# EAGLE board Replicape (EAGLE 5.12), part 1 of 2
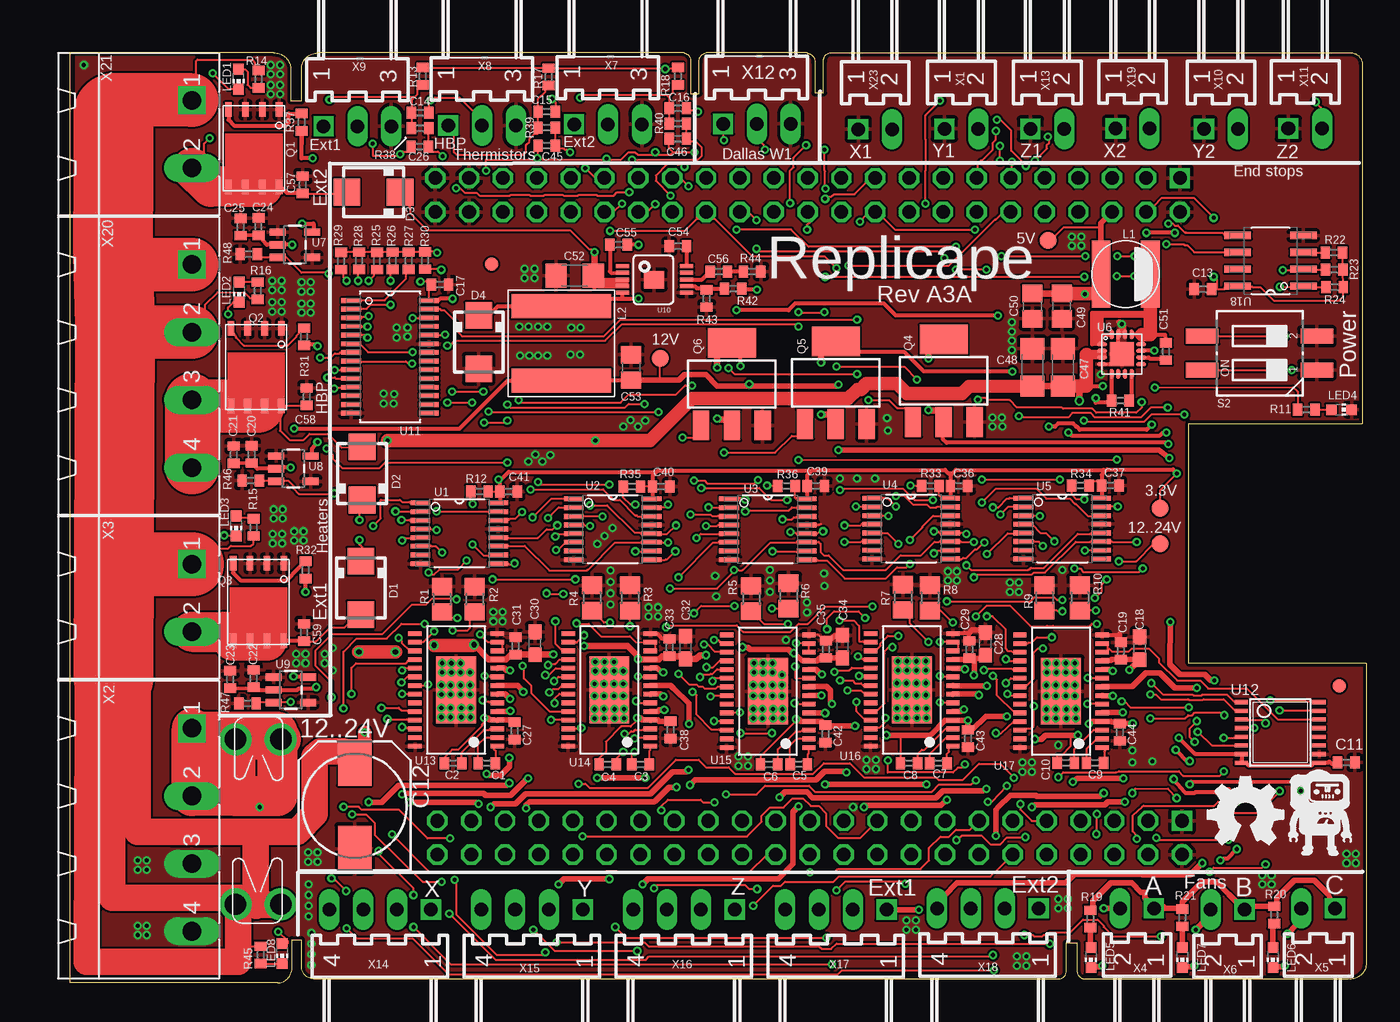
[diagram p3: board, top side]
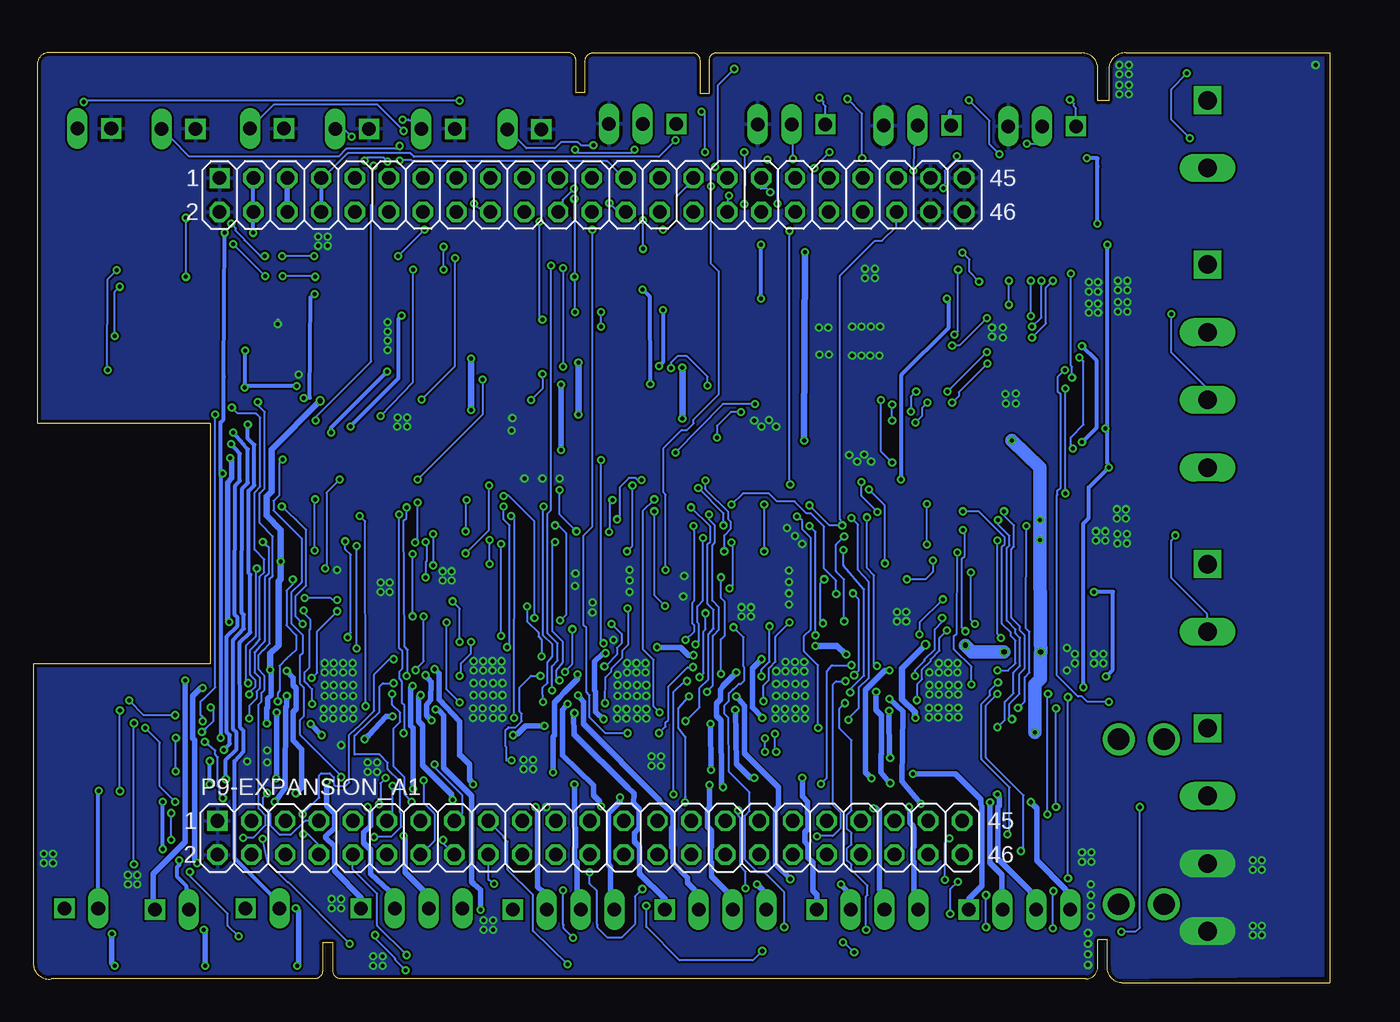
[diagram p4: board, bottom side, seen from below]

Size 97.3 x 69.83 mm. Coordinates in mm from the lower left corner, seen from the top.
Outline: 16.7,3.25 17.4,3.25 17.4,1.3 arc90 18.3,0.3 74.2,0.3 arc90 74.8,0.9 74.8,3 75.6,3 75.6,0.9 arc90 76.2,0.3 95.95,0.3 arc90 97.3,1.35 97.3,24 84,24 84,42 97,42 97,69 arc90 96.05,69.83 57.12,69.83 arc90 56.58,69.15 56.58,66.8 55.92,66.8 55.92,69.1 arc90 55.33,69.8 47.75,69.8 arc90 47.25,69.1 47.25,66.75 46.6,66.75 46.6,69.1 arc90 46.1,69.8 18.6,69.8 arc90 17.4,68.6 17.4,66.2 16.6,66.2 16.6,68.6 arc90 15.3,69.8 0,69.8 0,0 15.6,0 arc90 16.7,1.2 16.7,3.25
Copper layers (1*16): Top 0.035mm / dielectric 1.5mm / Bottom 0.035mm
Design rules "Fusion_eagle_rule_v1.1": minimum track width 6mil, minimum drill 12mil, track to track 6mil, track to pad 6mil, pad to pad 6mil, via to via 6mil, smd to smd 0mil, copper to edge 10mil, drill to drill 10mil, minimum pad ring 10mil, minimum via ring 6mil, stop-mask expansion 2mil, vias tented up to drill 100mil, thermal gap 10mil
Net classes: 1 power: width 1.27 mm

## Footprints (pad centres in the part's own frame; a part is rotated, then mirrored left to right if it is on the bottom)
B1,27 = smd 1.27 x 1.27: TP 0,0
C0402 = smd 0.7 x 0.9: 1 -0.65,0; 2 0.65,0
140CLH-0810 = smd 3.5 x 2.5: + 3.25,0; - -3.25,0
C0603 = smd 1.1 x 1: 1 -0.85,0; 2 0.85,0
C1206 = smd 1.6 x 1.8: 1 -1.4,0; 2 1.4,0
C0805 = smd 1.3 x 1.5: 1 -0.95,0; 2 0.95,0
SMA = smd 2 x 2: A 2,0; C -2,0
3557 = drill 1.6 round: 1 -6.2,1.7; 2 -6.2,-1.7; 3 6.2,-1.7; 4 6.2,1.7
FIDUCIAL-1X2.5 = smd 1 x 1: 1 0,0
VLC5020 = smd 5 x 1.4: 1 0,1.85; 2 0,-1.85
NR8040T330 = smd 1.8 x 7.5: P$1 2.8,0; P$2 -2.8,0
CHIP-LED0603 = smd 0.8 x 0.8: A 0,-0.75; C 0,0.75
2X23 = drill 1.016 square: 1 -30.48,1.27 | drill 1.016 octagon: 2 -30.48,-1.27; 3 -27.94,1.27; 4 -27.94,-1.27; 5 -25.4,1.27; 6 -25.4,-1.27; 7 -22.86,1.27; 8 -22.86,-1.27; 9 -20.32,1.27; 10 -20.32,-1.27; 11 -17.78,1.27; 12 -17.78,-1.27; 13 -15.24,1.27; 14 -15.24,-1.27; 15 -12.7,1.27; 16 -12.7,-1.27; 17 -10.16,1.27; 18 -10.16,-1.27; 19 -7.62,1.27; 20 -7.62,-1.27; 21 -5.08,1.27; 22 -5.08,-1.27; 23 -2.54,1.27; 24 -2.54,-1.27; 25 0,1.27; 26 0,-1.27; 27 2.54,1.27; 28 2.54,-1.27; 29 5.08,1.27; 30 5.08,-1.27; 31 7.62,1.27; 32 7.62,-1.27; 33 10.16,1.27; 34 10.16,-1.27; 35 12.7,1.27; 36 12.7,-1.27; 37 15.24,1.27; 38 15.24,-1.27; 39 17.78,1.27; 40 17.78,-1.27; 41 20.32,1.27; 42 20.32,-1.27; 43 22.86,1.27; 44 22.86,-1.27; 45 25.4,1.27; 46 25.4,-1.27
8-DFN-EP-(5X6) = smd 1.1 x 0.5: 1 -2.9,2.005; 2 -2.9,0.735; 3 -2.9,-0.535; 4 -2.9,-1.805; 5 2.9,-1.805; 6 2.9,-0.535; 7 2.9,0.735; 8 2.9,2.005
SOT223 = smd 1.219 x 2.235: 1 -2.311,-3.099; 2 0,-3.099; 3 2.311,-3.099 | smd 3.6 x 2.2: 4 0,3.099
R0805 = smd 1.3 x 1.5: 1 -0.95,0; 2 0.95,0
R0402 = smd 0.7 x 0.9: 1 -0.65,0; 2 0.65,0
CTS-219-02 = smd 1.13 x 2.44: 1 -1.27,-4.3; 2 1.27,-4.3; 3 1.27,4.3; 4 -1.27,4.3
SOP65P640X120-16N = smd 1.473 x 0.356: 1 -2.921,2.286; 2 -2.921,1.626; 3 -2.921,0.965; 4 -2.921,0.33; 5 -2.921,-0.33; 6 -2.921,-0.965; 7 -2.921,-1.626; 8 -2.921,-2.286; 9 2.921,-2.286; 10 2.921,-1.626; 11 2.921,-0.965; 12 2.921,-0.33; 13 2.921,0.33; 14 2.921,0.965; 15 2.921,1.626; 16 2.921,2.286
QFN-16 = smd 0.75 x 0.3: 1 -1.475,0.75; 2 -1.475,0.25; 3 -1.475,-0.25; 4 -1.475,-0.75; 9 1.475,-0.75; 10 1.475,-0.25; 11 1.475,0.25; 12 1.475,0.75 | smd 0.3 x 0.75: 5 -0.75,-1.475; 6 -0.25,-1.475; 7 0.25,-1.475; 8 0.75,-1.475; 13 0.75,1.475; 14 0.25,1.475; 15 -0.25,1.475; 16 -0.75,1.475 | smd 1.8 x 1.8: P$17 0,0
SOT23-5 = smd 0.55 x 1.2: 1 -0.95,-1.3; 2 0,-1.3; 3 0.95,-1.3; 4 0.95,1.3; 5 -0.95,1.3
MSOP10 = smd 0.3 x 1: 1 -1,-2.4; 2 -0.5,-2.4; 3 0.005,-2.4; 4 0.5,-2.4; 5 1,-2.4; 6 1,2.4; 7 0.5,2.4; 8 0.005,2.4; 9 -0.5,2.4; 10 -1,2.4 | smd 1.3 x 1.5: EP 0.02,-0.04
SOP65P640X110-28N = smd 1.473 x 0.356: 1 -2.921,4.216; 2 -2.921,3.581; 3 -2.921,2.921; 4 -2.921,2.286; 5 -2.921,1.626; 6 -2.921,0.965; 7 -2.921,0.33; 8 -2.921,-0.33; 9 -2.921,-0.965; 10 -2.921,-1.626; 11 -2.921,-2.286; 12 -2.921,-2.921; 13 -2.921,-3.581; 14 -2.921,-4.216; 15 2.921,-4.216; 16 2.921,-3.581; 17 2.921,-2.921; 18 2.921,-2.286; 19 2.921,-1.626; 20 2.921,-0.965; 21 2.921,-0.33; 22 2.921,0.33; 23 2.921,0.965; 24 2.921,1.626; 25 2.921,2.286; 26 2.921,2.921; 27 2.921,3.581; 28 2.921,4.216
TSSOP-16 = smd 0.305 x 0.991: 1 -2.275,-2.918; 2 -1.625,-2.918; 3 -0.975,-2.918; 4 -0.325,-2.918; 5 0.325,-2.918; 6 0.975,-2.918; 7 1.625,-2.918; 8 2.275,-2.918; 9 2.275,2.918; 10 1.625,2.918; 11 0.975,2.918; 12 0.325,2.918; 13 -0.325,2.918; 14 -0.975,2.918; 15 -1.625,2.918; 16 -2.275,2.918
TSSOP-28 = smd 0.35 x 1: 1 -4.225,-3.087; 2 -3.575,-3.087; 3 -2.925,-3.087; 4 -2.275,-3.087; 5 -1.625,-3.087; 6 -0.975,-3.087; 7 -0.325,-3.087; 8 0.325,-3.087; 9 0.975,-3.087; 10 1.625,-3.087; 11 2.275,-3.087; 12 2.925,-3.087; 13 3.575,-3.087; 14 4.225,-3.087; 15 4.225,3.087; 16 3.575,3.087; 17 2.925,3.087; 18 2.275,3.087; 19 1.625,3.087; 20 0.975,3.087; 21 0.325,3.087; 22 -0.325,3.087; 23 -0.975,3.087; 24 -1.625,3.087; 25 -2.275,3.087; 26 -2.925,3.087; 27 -3.575,3.087; 28 -4.225,3.087 | smd 5 x 3: EXP 0,0
SOIC127P600X175-8N = smd 1.981 x 0.533: 1 -2.464,1.905; 2 -2.464,0.635; 3 -2.464,-0.635; 4 -2.464,-1.905; 5 2.464,-1.905; 6 2.464,-0.635; 7 2.464,0.635; 8 2.464,1.905
7395-02 = drill 1.016 square: 1 1.27,0 | drill 1.016 long: 2 -1.27,0
MSTBA4 = drill 1.397 square: 1 -7.62,5.08 | drill 1.397 long: 2 -2.54,5.08; 3 2.54,5.08; 4 7.62,5.08
MSTBA2 = drill 1.397 square: 1 -2.54,5.08 | drill 1.397 long: 2 2.54,5.08
7395-03 = drill 1.016 square: 1 2.54,0 | drill 1.016 long: 2 0,0; 3 -2.54,0
7395-04 = drill 1.016 square: 1 3.81,0 | drill 1.016 long: 2 1.27,0; 3 -1.27,0; 4 -3.81,0

## Placement (x,y rotation side)
3.3V  TPB1,27  [B1,27]  81.83,35.62 0 top
5V  TPB1,27  [B1,27]  73.42,55.75 0 top
12..24V  TPB1,27  [B1,27]  81.85,32.98 0 top
12V  TPB1,27  [B1,27]  44.33,46.88 0 top
C1  10nF  [C0402]  31.3,16.5 0 top
C2  0.1uF  [C0402]  28.77,16.5 0 top
C3  10nF  [C0402]  42.85,16.4 0 top
C4  0.1uF  [C0402]  40.38,16.4 0 top
C5  10nF  [C0402]  54.73,16.43 0 top
C6  0.1uF  [C0402]  52.5,16.4 0 top
C7  10nF  [C0402]  65.2,16.5 0 top
C8  0.1uF  [C0402]  63,16.5 0 top
C9  10nF  [C0402]  76.95,16.52 0 top
C10  0.1uF  [C0402]  74.75,16.52 0 top
C11  0.1uF  [C0402]  95.8,16.55 0 top
C12  100uF  [140CLH-0810]  21.4,13.3 90 top
C13  0.1uF  [C0402]  85.03,52.08 180 top
C14  0.47uF  [C0402]  26.3,65.3 0 top
C15  0.47uF  [C0402]  35.8,65.4 0 top
C16  0.47uF  [C0402]  45.65,65.65 0 top
C17  0.1uF  [C0402]  27.8,52.43 0 top
C18  4.7uF  [C0603]  80.3,25.12 90 top
C19  0.1uF  [C0402]  78.88,24.93 90 top
C20  0.1uF  [C0402]  13.65,39.67 90 top
C21  4.7uF  [C0402]  12.32,39.65 90 top
C22  0.1uF  [C0402]  13.8,22.85 90 top
C23  4.7uF  [C0402]  12.06,22.79 90 top
C24  0.1uF  [C0402]  14.17,56.77 90 top
C25  4.7uF  [C0402]  12.82,56.74 90 top
C26  0.47uF  [C0402]  26.27,62.77 180 top
C27  0.1uF  [C0402]  33.4,18.93 270 top
C28  4.7uF  [C0603]  68.72,25.45 90 top
C29  0.1uF  [C0402]  67.53,25.02 90 top
C30  4.7uF  [C0603]  34.92,25.5 90 top
C31  0.1uF  [C0402]  33.45,25.3 90 top
C32  4.7uF  [C0603]  46.23,25.18 90 top
C33  0.1uF  [C0402]  45.02,25.18 90 top
C34  4.7uF  [C0603]  58,25.25 90 top
C35  0.1uF  [C0402]  56.77,25.05 90 top
C36  0.1uF  [C0402]  66.75,37.3 0 top
C37  0.1uF  [C0402]  78.1,37.35 0 top
C38  0.1uF  [C0402]  45.1,19 270 top
C39  0.1uF  [C0402]  56,37.3 0 top
C40  0.1uF  [C0402]  44.4,37.25 0 top
C41  0.1uF  [C0402]  32.94,36.88 0 top
C42  0.1uF  [C0402]  56.73,18.7 270 top
C43  0.1uF  [C0402]  67.42,18.35 270 top
C44  0.1uF  [C0402]  78.8,18.82 270 top
C45  0.47uF  [C0402]  35.8,62.85 180 top
C46  0.47uF  [C0402]  45.65,63.35 180 top
C47  10uF  [C1206]  74.55,46.2 90 top
C48  10uF  [C1206]  72.25,46.2 90 top
C49  22uF  [C0805]  74.45,50.8 270 top
C50  22uF  [C0805]  72.25,50.8 270 top
C51  22nF  [C0402]  82.28,47.4 90 top
C52  10uF  [C1206]  37.9,53.1 180 top
C53  22uF  [C0805]  42.15,46.2 90 top
C54  10nF  [C0402]  45.65,55.3 180 top
C55  10nF  [C0402]  41.2,55.4 0 top
C56  1nF  [C0402]  48.73,53.4 0 top
C57  4.7nF  [C0402]  17.5,59.9 90 top
C58  4.7nF  [C0402]  17.8,44 90 top
C59  4.7nF  [C0402]  17.6,26.3 90 top
D1  MBRA340T3  [SMA]  21.85,29.65 270 top
D2  MBRA340T3  [SMA]  21.95,38.25 90 top
D3  MBRA340T3  [SMA]  22.8,59.35 180 top
D4  MBRA340T3  [SMA]  30.7,48.1 270 top
F1  3557  [3557]  14.15,12.1 270 top
JP1  FIDUCIAL1X2.5  [FIDUCIAL-1X2.5]  31.65,53.95 0 top
JP2  FIDUCIAL1X2.5  [FIDUCIAL-1X2.5]  95.28,22.3 0 top
L1  4.7uH  [VLC5020]  79.25,53.2 270 top
L2  33uH  [NR8040T330]  36.9,48 270 top
LED1  blue  [CHIP-LED0603]  12.68,67.83 180 top
LED2  blue  [CHIP-LED0603]  12.72,51.85 180 top
LED3  blue  [CHIP-LED0603]  12.5,34.3 180 top
LED4  blue  [CHIP-LED0603]  95.45,43.02 270 top
LED5  blue  [CHIP-LED0603]  76.65,1.9 180 top
LED6  blue  [CHIP-LED0603]  90.3,1.9 180 top
LED7  blue  [CHIP-LED0603]  83.5,1.9 180 top
LED8  red  [CHIP-LED0603]  15.95,2.2 180 top
LOGO1  OSHW_LOGO_FILLX0200-NT  [OSHW_FILLX200_NOTEXT]  85.4,10.4 0 top
P9-EXPANSION_A  BEAGLE_EXT9  [2X23]  52.84,59.14 0 bottom
P9-EXPANSION_A1  BEAGLE_EXT9  [2X23]  53,10.9 0 bottom
Q1  AON6758  [8-DFN-EP-(5X6)]  13.72,62.65 270 top
Q2  AON6758  [8-DFN-EP-(5X6)]  13.9,46.23 270 top
Q3  AON6758  [8-DFN-EP-(5X6)]  14.07,28.6 270 top
Q4  NIF5002  [SOT223]  65.6,45.2 0 top
Q5  NIF5002  [SOT223]  57.5,45.05 0 top
Q6  NIF5002  [SOT223]  49.7,44.95 0 top
R1  0.1R  [R0805]  27.95,28.8 270 top
R2  0.1R  [R0805]  30.4,28.8 270 top
R3  0.1R  [R0805]  42.05,28.9 270 top
R4  0.1R  [R0805]  39.2,28.9 270 top
R5  0.1R  [R0805]  51.15,28.85 270 top
R6  0.1R  [R0805]  53.95,29.05 270 top
R7  0.1R  [R0805]  62.55,28.95 270 top
R8  0.1R  [R0805]  64.55,28.9 270 top
R9  0.1R  [R0805]  73.15,28.9 270 top
R10  0.1R  [R0805]  75.8,28.9 270 top
R11  4.7K  [R0402]  92.8,43.02 180 top
R12  4.7K  [R0402]  30.75,36.9 0 top
R13  4K7, 1%  [R0402]  26.5,68.05 90 top
R14  4.7K  [R0402]  14.18,67.83 90 top
R15  4.7K  [R0402]  13.8,34.2 270 top
R16  4.7K  [R0402]  14.12,51.95 270 top
R17  4K7, 1%  [R0402]  35.95,68 90 top
R18  4K7, 1%  [R0402]  45.65,68.05 90 top
R19  4.7K  [R0402]  76.6,4.8 90 top
R20  4.7K  [R0402]  90.4,5.1 90 top
R21  4.7K  [R0402]  83.5,4.9 90 top
R22  4.7K  [R0402]  94.88,54.83 0 top
R23  4.7K  [R0402]  94.9,53.52 0 top
R24  4.7K  [R0402]  94.92,52.23 0 top
R25  4.7K  [R0402]  23.06,54.19 90 top
R26  4.7K  [R0402]  24.25,54.2 90 top
R27  4.7K  [R0402]  25.45,54.2 90 top
R28  4.7K  [R0402]  21.71,54.2 90 top
R29  4.7K  [R0402]  20.36,54.19 90 top
R30  4.7K  [R0402]  26.66,54.23 90 top
R31  100R  [R0402]  17.6,48.5 270 top
R32  100R  [R0402]  17.7,31 270 top
R33  4.7K  [R0402]  64.6,37.3 0 top
R34  4.7K  [R0402]  75.85,37.35 0 top
R35  4.7K  [R0402]  42.2,37.25 0 top
R36  4.7K  [R0402]  53.8,37.3 0 top
R37  100R  [R0402]  17.4,64.6 270 top
R38  6.8K  [R0402]  26.3,64.15 0 top
R39  6.8K  [R0402]  35.8,64.2 0 top
R40  6.8K  [R0402]  45.65,64.5 0 top
R41  10K  [R0402]  78.85,43.7 180 top
R42  120K  [R0402]  49.8,52.1 180 top
R43  10K  [R0402]  47.8,51.38 270 top
R44  40K  [R0402]  51.23,53.4 0 top
R45  4.7K  [R0402]  14.35,2.1 270 top
R46  4.7K  [R0402]  13.6,37.7 0 top
R47  4.7K  [R0402]  13.35,21 0 top
R48  4.7K  [R0402]  13.45,54.7 0 top
S2  219-02  [CTS-219-02]  89.3,47.27 90 top
U1  SN74AHC595PW  [SOP65P640X120-16N]  29.25,33.75 0 top
U2  SN74AHC595PW  [SOP65P640X120-16N]  40.75,34.05 0 top
U3  SN74AHC595PW  [SOP65P640X120-16N]  52.4,34.05 0 top
U4  SN74AHC595PW  [SOP65P640X120-16N]  63.15,34.1 0 top
U5  SN74AHC595PW  [SOP65P640X120-16N]  74.5,34.1 0 top
U6  MCP16321  [QFN-16]  78.95,47.2 0 top
U7  MCP1402  [SOT23-5]  16.9,55.4 270 top
U8  MCP1402  [SOT23-5]  16.8,38.6 270 top
U9  MCP1402  [SOT23-5]  16.6,22 270 top
U10  RT8268  [MSOP10]  43.9,52.8 270 top
U11  PCA9685PW  [SOP65P640X110-28N]  24.05,47 0 top
U12  DAC088S085  [TSSOP-16]  90.85,18.8 270 top
U13  DRV8825PWP  [TSSOP-28]  29,22 90 top
U14  DRV8825PWP  [TSSOP-28]  40.5,22 90 top
U15  DRV8825PWP  [TSSOP-28]  52.4,21.9 90 top
U16  DRV8825PWP  [TSSOP-28]  63.2,22 90 top
U17  DRV8825PWP  [TSSOP-28]  74.4,21.9 90 top
U18  CAT24C256  [SOIC127P600X175-8N]  90.12,54.2 180 top
U$1  [LOGO_BIG]  93.4,12.85 0 top
X1  22-05-7028-02  [7395-02]  66.92,64.1 180 top
X2  MSTBA4  [MSTBA4]  4.1,11.5 270 top
X3  MSTBA2  [MSTBA2]  4.1,28.9 270 top
X4  22-05-7028-02  [7395-02]  80.1,5.6 0 top
X5  22-05-7028-02  [7395-02]  93.7,5.6 0 top
X6  22-05-7028-02  [7395-02]  86.9,5.5 0 top
X7  22-05-7038-03  [7395-03]  40.4,64.45 180 top
X8  22-05-7038-03  [7395-03]  30.95,64.35 180 top
X9  22-05-7038-03  [7395-03]  21.6,64.3 180 top
X10  22-05-7028-02  [7395-02]  86.4,64.1 180 top
X11  22-05-7028-02  [7395-02]  92.72,64.12 180 top
X12  22-05-7038-03  [7395-03]  51.58,64.47 180 top
X13  22-05-7028-02  [7395-02]  73.38,64.1 180 top
X14  22-05-7048-04  [7395-04]  23.3,5.5 0 top
X15  22-05-7048-04  [7395-04]  34.7,5.5 0 top
X16  22-05-7048-04  [7395-04]  46.1,5.5 0 top
X17  22-05-7048-04  [7395-04]  57.5,5.5 0 top
X18  22-05-7048-04  [7395-04]  68.9,5.6 0 top
X19  22-05-7028-02  [7395-02]  79.78,64.12 180 top
X20  MSTBA4  [MSTBA4]  4.1,46.3 270 top
X21  MSTBA2  [MSTBA2]  4.1,63.7 270 top
X23  22-05-7028-02  [7395-02]  60.45,64.08 180 top

## Tracks (layer width: path | path; a pad name or v marks a point on that pad's centre or on a via)
+3V3  (via drill 0.3)
  Top 0.152: R22.2 R23.2 R24.2 95.58,51.52 95.25,51.2 90.35,51.23 89.35,52.23 88.78,52.23 88.72,52.27 88.35,52.27 U18.8 88.28,52.27 86.72,52.25 86.67,52.2 86.67,52.08 C13.1 86.08,52.15 86.08,52.77 v85.85,53 | R34.2 76.5,37.65 77.35,37.65 C37.1 | R33.2 65.25,36.6 65.45,36.4 65.95,36.4 U4.16 | R29.2 20.4,54.85 R28.2 23,54.85 R25.2 23.1,54.85 R26.2 R27.2 26.64,54.85 R30.2 26.73,54.88 27.32,54.88 27.35,54.85 27.55,54.85 v27.57,54.83 | R36.2 54.45,36.4 54.5,36.35 55.2,36.35 U3.16 | C40.1 R35.2 | R12.2 32.27,36.9 C41.1 | U11.28 26.97,52.26 C17.1 27.15,52.5 27.15,52.65 v26.32,52.65 | v85.85,57.42 84.35,58.92 81.97,58.92 81.35,58.3 81.35,57.9 81.33,57.88 80.8,57.88 P9-EXPANSION_A.4 | 3.3V.TP 81.83,36.98 v83.1,38.25
  Top 0.3: 77.7,38.4 77.45,38.15 C37.1 77.45,36.4 U5.16 | 77.7,38.4 77.85,38.55 82.8,38.55 v83.1,38.25 | 66.15,38.15 66.1,38.1 C36.1 66.1,36.4 U4.16 | 66.15,38.15 66.5,38.5 77.6,38.5 77.7,38.4 | 55.6,38.35 55.35,38.1 C39.1 55.35,36.35 U3.16 | 55.6,38.35 55.75,38.5 65.7,38.5 65.95,38.25 66.05,38.25 66.15,38.15 | 43.95,38.25 43.75,38.05 C40.1 43.75,36.35 43.7,36.35 U2.16 | 43.95,38.25 44.15,38.45 55.5,38.45 55.6,38.35 | 32.3,37.7 32.3,36.9 C41.1 32.3,36.75 32.3,36.05 32.2,36.05 U1.16 | 32.3,37.7 32.95,38.35 43.85,38.35 43.95,38.25 | 87.95,17.2 84.45,17.2 v83.25,18.4 | 87.95,17.2 U12.8 88.05,16.55 88.25,16.55 88.45,16.35 93.2,16.35 93.4,16.55 93.75,16.55 U12.9 93.9,16.55 94.45,16.55 94.5,16.6 94.55,16.6 94.7,16.45 95.15,16.45 C11.1 | 87.95,17.15 87.95,16.7 | 87.95,17.15 U12.7 | 87.95,17.2 87.95,17.15 | v82.95,56.3 v80.8,56.3 | v28.75,51.35 27.8,51.35 27.65,51.2 27,51.2 U11.28 | 32.3,37.7 v32.2,37.8
  Bottom 0.152: v26.32,52.65 27.05,53.38 27.05,54.3 v27.57,54.83 | v85.85,57.42 v85.85,53
  Bottom 0.3: P9-EXPANSION_A.4 80.8,57.9 80.8,60.4 P9-EXPANSION_A.3 | P9-EXPANSION_A.4 80.8,57.75 | v83.25,18.4 83.25,38.1 v83.1,38.25 83.25,38.3 83.25,42.08 83.03,42.3 83,45.5 v82.95,56.3 | v80.8,56.3 80.8,57.6 P9-EXPANSION_A.4 | v32.2,37.8 32.15,37.8 32.15,45.65 28.6,49.2 28.6,51.2 v28.75,51.35
AGND  (via drill 0.3)
  Top 0.152: X8.2 30.4,64.35 30.35,64.4 30.35,65.4 30.3,65.4 29.25,66.45 27.4,66.45 27.15,66.2 | 27.15,66.2 26.95,66 C14.2 | C26.2 25.65,62.4 25,62.4 24.95,62.35 24.9,62.35 24.77,62.23 | 24.77,62.23 24.65,62.1 22.75,62.1 v22.75,63 | v27.1,66.25 27.15,66.2 | 24.77,62.23 v24.8,62.2 | C45.2 35.15,62.15 35,62 | 35,62 34.8,61.8 31.25,61.8 v31.25,60.98 | C15.2 36.45,66.1 v36.2,66.35 | 35,62 v35.1,61.9 35.15,61.85 35.45,61.85 35.5,61.8 40.3,61.8 | C46.2 45,62.65 45.3,62.35 | 45.3,62.35 v46.9,62.35 | v47.15,65.4 47.1,65.45 46.3,65.45 C16.2 | 40.3,61.8 41.4,61.8 41.95,62.35 42.45,62.35 42.65,62.15 43.95,62.15 | 43.95,62.15 45.1,62.15 45.3,62.35 | 40.3,61.8 v40.3,61.85 | v43.95,58.45 43.35,57.85 42.7,57.85 P9-EXPANSION_A.34 | 43.95,62.15 v43.95,62.35
  Bottom 0.152: v22.75,63 21.75,63 21.6,63.15 X9.2 | v27.1,66.25 25.55,64.7 25.55,62.95 v24.8,62.2 | v31.25,60.98 31.23,62.73 30.95,63 X8.2 | v36.2,66.35 35.1,65.25 v35.1,61.9 | v46.9,62.35 46.9,65.15 v47.15,65.4 | v40.3,61.85 40.3,62.95 40.4,63.05 X7.2 | v43.95,58.45 43.95,59.8 43.9,59.85 43.9,60.95 43.95,61 v43.95,62.35
DALLAS_W1  (via drill 0.3)
  Top 0.152: v56.73,59.62 56.73,59.75 56.7,59.77 56.7,60.92 56.65,60.98 v56.65,62.55 | v52.17,62.55 52.1,62.62 52.1,62.88 51.58,63.4 X12.2
  Bottom 0.152: v56.73,59.62 57.55,58.8 57.55,57.88 57.9,57.88 P9-EXPANSION_A.22 | v56.65,62.55 56.42,62.33 52.4,62.33 v52.17,62.55
DIR_EXT_1  (via drill 0.3)
  Top 0.152: U16.20 59.38,22.98 v59.25,23.05 | v67.2,16.4 66.95,16.15 66.65,16.15 66.3,15.8 61.4,15.8 v61.4,16.7
  Bottom 0.152: v59.25,23.05 59.95,23.05 60.8,22.2 60.8,20.35 60.65,20.2 60.65,19.65 61.1,19.2 61.65,19.2 61.85,19 61.85,17.75 61.8,17.7 61.8,16.7 v61.4,16.7 | v67.2,16.4 67.2,16.2 65.1,14.1 65.1,12.77 P9-EXPANSION_A1.15
DIR_EXT_2  (via drill 0.3)
  Top 0.152: U17.20 70.62,22.88 v70.25,22.5 | v71.72,10.95 71.72,10.93 70.35,10.93 69.85,10.4 69.1,10.4 68.42,11.07 66.95,11.07 v66.55,10.72
  Bottom 0.152: v70.25,22.5 71.08,22.5 71.33,22.25 71.33,20.35 73.03,18.7 73.17,18.57 73.2,18.55 73.2,17.12 73.17,17.15 71.33,17.15 70.7,16.52 70.7,16.05 69.78,15.12 69.78,12.8 69.7,12.72 69.7,11.72 70.42,11 71.72,11 v71.72,10.95 | v66.55,10.72 66.53,10.46 P9-EXPANSION_A1.16
DIR_X  (via drill 0.3)
  Top 0.152: v24.2,11.15 27,8.3 40.2,8.3 40.3,8.4 41.1,8.4 41.2,8.3 51,8.3 52.33,9.63 P9-EXPANSION_A1.26 | v24.9,22.55 25.35,23 25.4,23 25.45,22.95 25.5,23 25.9,23 U13.20
  Bottom 0.152: v24.2,11.15 24.05,11.3 24.05,14.7 26.15,16.8 26.15,20.95 25.5,21.6 25.5,21.95 v24.9,22.55
DIR_Y  (via drill 0.3)
  Top 0.152: U14.20 36.67,22.98 v36.35,22.65 | v38.5,11 50.84,11 51.94,12.1 51.94,12.56 52.55,13.18 53.58,13.18 54.25,13.85 55.05,13.85 55.62,13.28 56.23,13.28 56.77,12.72 56.77,11.78 57.65,10.9 59.35,10.9 P9-EXPANSION_A1.19
  Bottom 0.152: v36.35,22.65 37.05,22.65 37.3,22.4 37.3,13.38 36.7,12.78 36.7,11.62 37.3,11.03 38.48,11.03 v38.5,11
DIR_Z  (via drill 0.3)
  Top 0.152: v48.25,22.65 48.25,22.75 48.4,22.9 49.3,22.9 U15.20 | v49.25,14.15 51.55,14.15 52.2,14.8 55.5,14.8 55.92,14.35 64.7,14.35 65.25,14.9 67.65,14.9 v68,15.2
  Bottom 0.152: v48.25,22.65 48.45,22.65 49.25,21.85 v49.25,14.15 | v68,15.2 68,13.5 67.2,12.7 67.2,10.67 P9-EXPANSION_A1.14
END_STOP_X_1  (via drill 0.3)
  Top 0.152: v54.08,58.52 54.08,60.98 54.33,61.23 54.33,61.92 v55.27,62.88
  Bottom 0.152: v54.08,58.52 53.42,57.88 P9-EXPANSION_A.26 | v55.27,62.88 55.3,62.85 56.17,62.85 56.42,63.1 57.7,63.1 58.15,62.65 60.3,62.65 61.08,63.42 61.08,64.08 X23.2
END_STOP_X_2  (via drill 0.3)
  Top 0.152: v69.5,63.95 69.5,63.27 69.28,63.05 69.28,62.55 68.45,61.73 68.38,61.73 68.17,61.52 68.17,61.15 68.08,61.05 68.08,60.42 P9-EXPANSION_A.13
  Bottom 0.152: v69.5,63.95 71.45,65.9 79.28,65.9 80.3,64.88 80.38,64.88 80.38,64.25 80.5,64.12 X19.2
END_STOP_Y_1  (via drill 0.3)
  Top 0.152: v84.42,18.1 84.05,18.45 84.05,19.1 v84.6,19.65 | v83.65,42.65 81.17,42.65 80.62,42.1 76.25,42.1 v76.1,42.23 | v79.75,14.25 80,14.6 82.42,14.57 v83.08,13.88 | v69.58,64.8 69.85,64.8 70.67,63.98 70.67,62.45 71.75,61.38 v71.75,61.33
  Bottom 0.152: 79.7,12.9 79.5,12.7 79.5,11.8 78.8,11.1 78,11.1 76.9,12.15 76.87,12.17 P9-EXPANSION_A1.7 | 79.7,12.9 79.7,13 | v84.6,19.65 84.6,19.98 84.72,20.1 84.72,21.15 84.65,21.23 84.6,21.25 83.65,22.2 v83.65,42.65 | v84.42,18.1 83.65,17.43 83.65,17.15 83.45,16.95 83.45,14.75 83.3,14.6 83.3,14.07 v83.08,13.88 | v76.1,42.23 76.08,42.52 71.95,46.65 71.95,58.4 71.85,58.5 71.85,60.95 71.9,61 71.85,61.05 71.85,61.3 71.78,61.33 v71.75,61.33 | v79.75,14.25 80.05,13.95 80.05,13.2 79.75,12.9 79.7,12.9 | v69.58,64.8 69.15,64.8 69.1,64.75 68.88,64.75 68.88,64.25 68.72,64.1 X1.2
END_STOP_Y_2  (via drill 0.3)
  Top 0.152: v69.83,61.73 v69.83,62.83
  Bottom 0.152: v69.83,62.83 70.05,62.6 73.83,62.6 74.4,62.02 85.6,62.02 86.92,63.35 87,63.35 87,63.98 87.12,64.1 X10.2 | v69.83,61.73 69.8,61.75 68.92,61.75 68.85,61.67 54.23,61.67 53.38,60.83 53.38,60.4 P9-EXPANSION_A.25
END_STOP_Z_1  (via drill 0.3)
  Top 0.152: v73.42,63.52 73.53,63.42 73.53,63.08 73.35,62.9 73.35,62.62 v72.45,61.73 | v70.7,61.65 70.7,61.12 70.62,61.05 70.62,60.42 P9-EXPANSION_A.11
  Bottom 0.152: v73.42,63.52 74,64.1 X13.2 | v72.45,61.73 72.22,61.95 71,61.95 v70.7,61.65
END_STOP_Z_2  (via drill 0.3)
  Top 0.152: v64.22,58.5 64.22,60.98 64.25,61 64.25,63.27 64.22,63.3 64.22,65.12 v65.33,66.22 | v93.53,66.12 93.53,66.08 93.9,65.7 93.9,65.62 94,65.53 X11.2
  Bottom 0.152: v64.22,58.5 63.6,57.88 P9-EXPANSION_A.18 | v65.33,66.22 93.42,66.22 v93.53,66.12
EXT1_DECAY  (via drill 0.3)
  Top 0.152: v62,36.55 62.05,36.6 62.6,36.6 63.3,35.9 64.35,35.9 64.55,35.7 65.05,35.7 65.1,35.75 66.05,35.75 U4.15 | v59.7,27.4 59.2,27.9 57.38,27.9 56.85,27.38 v56.85,26.55 | v57.4,23.35 57.5,23.45 58.5,23.45 58.7,23.65 60.1,23.65 U16.19
  Bottom 0.152: v62,36.55 61.95,36.6 61.65,36.6 59.7,34.65 v59.7,27.4 | v56.85,26.55 56.85,23.95 57.4,23.4 v57.4,23.35
EXT1_MODE0  (via drill 0.3)
  Top 0.152: v62,35.75 61.4,36.35 61.3,36.35 61.25,36.4 60.25,36.4 U4.1 | v61.75,25.2 61.45,25.2 61.15,24.9 61.15,24.85 61.1,24.8 61.1,24.75 61.15,24.7 61.15,21 60.55,20.4 60.15,20.4 U16.24
  Bottom 0.152: v62,35.75 62,34.8 61.55,34.35 61.55,25.4 v61.75,25.2
EXT1_NENABLE  (via drill 0.3)
  Top 0.152: v58.15,33.1 59.4,33.1 59.45,33.15 60.2,33.15 U4.6 | v57.83,22.7 58.75,22.7 58.95,22.5 59.4,22.5 59.55,22.35 60.1,22.35 U16.21
  Bottom 0.152: v58.15,33.1 58.35,32.9 58.35,26.4 57.55,25.6 57.55,24.05 58.05,23.45 58.05,22.93 v57.83,22.7
EXT1_NRESET  (via drill 0.3)
  Top 0.152: v58.15,34.35 59.35,34.35 59.45,34.45 60.2,34.45 U4.4 | v57.77,27.2 58.85,27.2 59.25,26.8 59.25,25.65 59.5,25.65 59.55,25.6 60.1,25.6 U16.16
  Bottom 0.152: v58.15,34.35 57.9,34.35 57.3,33.75 57.3,27.68 v57.77,27.2
EXT1_NSLEEP  (via drill 0.3)
  Top 0.152: v62.2,32.95 61.4,33.75 60.25,33.75 U4.5 | v62.2,26.05 61.4,26.05 60.85,25.5 60.85,25.3 60.6,25.05 60.55,25.05 60.45,24.95 60.15,24.95 U16.17
  Bottom 0.152: v62.2,26.05 v62.2,32.95
FAN_1  (via drill 0.3)
  Top 0.152: v25.75,47.35 22.4,47.35 21.8,47.95 21.15,47.95 U11.6 | v28.7,44.4 v31.05,44.4 | v31.45,42.9 31.5,42.85 v44.2,42.85 | v46,40.95 47.2,40.95 47.35,41.1 47.4,41.8 47.4,41.65 Q6.1
  Bottom 0.152: v25.75,47.35 v28.7,44.4 | v31.05,44.4 31.45,44 v31.45,42.9 | v44.2,42.85 44.95,42.85 46,41.8 v46,40.95
FAN_2  (via drill 0.3)
  Top 0.152: v59.95,43.75 61.5,43.75 62.1,43.15 63.25,43.15 63.25,42.3 Q4.1 | v59.1,45.7 49.9,45.7 v49.45,46.15 | v46.7,44.85 46.2,44.85 45.5,44.15 41.95,44.15 41.35,43.55 33.9,43.55 v33.7,43.75 | v32.85,39.05 23.68,39.05 23.27,38.65 20.45,38.65 19.75,39.35 19.75,39.65 v19.3,40.1 | v18.8,46.95 19.6,46.95 19.9,47.25 20.25,47.25 20.35,47.35 21.1,47.35 U11.7
  Bottom 0.152: v59.95,43.75 59.1,44.6 v59.1,45.7 | v49.45,46.15 49.45,46.55 48.95,47.05 48.25,47.05 46.7,45.5 v46.7,44.85 | v33.7,43.75 33.7,39.9 v32.85,39.05 | v19.3,40.1 19.45,40.25 19.45,40.95 18.5,41.9 18.5,46.65 v18.8,46.95
FAN_3  (via drill 0.3)
  Top 0.152: v25.7,46.5 25.4,46.5 25.25,46.65 21.15,46.65 U11.8 | v28.35,43.55 v30.2,43.55 | v31.1,42.05 32.7,42.05 v32.85,42.2 | v32.85,43.4 33.05,43.2 41.7,43.2 41.95,43.45 v43.15,43.45 | v49.1,39.8 52.95,39.8 54.2,41.05 55.15,41.05 55.2,41.1 Q5.1
  Bottom 0.152: v25.7,46.5 27.85,44.35 27.85,44.05 v28.35,43.55 | v30.2,43.55 30.6,43.15 30.6,42.55 v31.1,42.05 | v32.85,42.2 v32.85,43.4 | v43.15,43.45 45.55,43.45 v49.1,39.8
FAULT_EXT_1  (via drill 0.3)
  Top 0.152: v62.73,7.45 62.58,7.62 58.23,7.62 v57.55,6.95 | v56.8,3.4 41.75,3.4 v40.95,4.2 | v44.75,26.7 44.9,26.85 50.05,26.85 50.55,26.35 54.1,26.35 54.7,26.95 55.4,26.95 56.7,28.25 v60.25,28.25 | v59.15,24.5 59.3,24.35 59.5,24.35 59.55,24.3 60.1,24.3 U16.18
  Bottom 0.152: v62.73,7.45 63.15,7.72 63.15,9.6 P9-EXPANSION_A1.18 | v57.55,6.95 57.55,4.4 57.5,4.35 57.5,4.1 v56.8,3.4 | v40.95,4.2 40.95,6.8 42.45,8.3 42.95,8.3 43.9,9.25 43.9,12.55 43.55,12.9 43.55,14.3 45.1,15.85 45.15,19.9 45.45,20.2 45.45,20.82 45.1,21.18 45.1,21.75 44.8,22.05 44.75,22.05 44.35,22.45 44.2,22.45 43.95,22.7 43.95,23.7 44,23.75 44,25.95 v44.75,26.7 | v60.25,28.25 60.25,27.15 59.4,26.3 59.4,26 59.15,25.75 v59.15,24.5
FAULT_EXT_2  (via drill 0.3)
  Top 0.152: v77.1,12.68 77.1,11.35 v77.05,11.18 | U17.18 70.38,24.18 v70.25,24.3
  Bottom 0.152: v77.05,11.18 76.7,11.18 75.86,10.34 P9-EXPANSION_A1.8 | v70.25,24.3 70.6,24.3 71.72,23.18 71.72,20.43 72.85,19.3 73.47,18.75 73.6,18.62 73.6,15.05 73.85,14.8 74.62,14.8 74.75,14.93 74.75,15.45 75.05,15.75 75.7,15.75 75.85,15.6 75.85,13.93 v77.1,12.68
FAULT_X  (via drill 0.3)
  Top 0.152: v69.3,2.1 69.2,2 43.5,2 43.25,1.75 31.95,1.75 v28.5,5.2 | v27.93,7.6 26.5,7.6 22.9,11.1 22.9,12 22.25,12.65 v21.2,12.65 | v21.15,21.7 21.15,23.65 21.5,24 25.25,24 25.45,24.2 25.9,24.2 25.9,24.3 U13.18
  Bottom 0.152: v69.3,2.1 71.5,4.3 71.5,6.7 73.32,8.52 P9-EXPANSION_A1.10 | v28.5,5.2 28.5,7.03 v27.93,7.6 | v21.2,12.65 21.2,21.65 v21.15,21.7
FAULT_Y  (via drill 0.3)
  Top 0.152: v70.85,15.4 70.85,15.45 69.85,16.45 68.25,16.45 67.05,15.25 65.2,15.25 65,15.45 59.6,15.45 58.55,16.5 56.6,16.5 55.8,15.7 49.95,15.7 49.45,16.2 47.75,16.2 47.2,16.75 45.5,16.75 43.4,14.65 39,14.65 38.7,14.95 v38.2,14.95 | v71.35,13.43 71.35,13.03 72.2,12.15 73.3,12.15 P9-EXPANSION_A1.9 | U14.18 36.77,24.27 36.45,23.95 36,23.95 v35.9,23.85
  Bottom 0.152: v70.85,15.4 71.25,15 71.25,13.53 v71.35,13.43 | v35.9,23.85 37.35,23.85 37.75,23.4 37.75,15.4 v38.2,14.95
FAULT_Z  (via drill 0.3)
  Top 0.152: v55.35,56.55 55.35,56.9 55.6,57.15 55.6,57.85 55.4,57.85 P9-EXPANSION_A.24 | v50.35,18.75 v52.7,18.75 | v47.8,23.7 48.3,23.7 48.8,24.2 49.3,24.2 U15.18
  Bottom 0.152: 55.5,57.8 55.43,57.87 P9-EXPANSION_A.24 | v55.35,56.55 55.35,34.25 56,33.6 56,26.85 55.8,26.65 55.8,21.85 55.55,21.6 55.55,19.95 54.35,18.75 v52.7,18.75 | v50.35,18.75 49.85,19.25 49.85,19.55 49.65,19.75 49.65,22.25 48.2,23.7 v47.8,23.7
GND  (via drill 0.3)
  Top 0.152: 56.39,34.43 56.35,34.45 56.3,34.4 55.35,34.4 U3.13 | C35.2 56.6,25.7 56.15,26.15 55.51,26.15 U15.14
  Top 0.3: 78.7,49.62 78.9,49.62 78.9,48.75 U6.15 78.7,47.2 U6.P$17 78.95,46.45 U6.4 | v78.95,49.45 79.15,49.5 79.15,48.67 U6.14 | 67.05,26.25 66.35,26.25 U16.14 | 67.05,26.25 67.12,26.28 | U17.14 78.67,26.12 78.8,26.25 78.8,25.55 C19.2 | 67.05,26.25 67.47,26.25 C29.2 | U14.14 44.1,26.23 44.5,25.82 C33.2
  Top 0.4: C28.2 68.7,26.35 68.55,26.5 67.72,26.5 67.47,26.25 | C35.2 57.02,25.7 57.42,26.1 C34.2
  Bottom 0.3: v78.95,49.45 78.95,49.75
  other vias: 17.9,9.8 18.6,9.8 17.9,9.1 18.6,9.1 5.1,9.2 5.8,9.2 5.1,8.5 5.8,8.5 17,24.7 17.7,24.7 17,24 17.7,24 19.15,24.7 19.75,25.15 19.15,24 19.75,23.45 15.1,68.9 15.8,68.9 15.1,68.2 15.8,68.2 15.1,67.4 15.8,67.4 15.1,66.7 15.8,66.7 15.2,52.7 15.9,52.7 15.2,52 15.9,52 15.2,51.1 15.9,51.1 15.2,50.4 15.9,50.4 17.4,52.6 18.1,52.6 17.4,51.9 18.1,51.9 17.4,51 18.1,51 17.4,50.3 18.1,50.3 62.8,4.7 63.5,4.7 62.8,4 63.5,4 17.95,7.4 17.95,6.6 17.95,5.8 17.95,5 18.15,3.75 18.15,2.95 18.15,2.15 18.15,1.35 95.83,9.7 96.53,9.7 95.83,9 96.53,9 89.5,8.1 90.2,8.1 89.5,7.4 90.2,7.4 71.1,2 71.8,2 71.1,1.3 71.8,1.3 74.2,6.3 74.9,6.3 74.2,5.6 74.9,5.6 58.8,13.2 15.3,35.55 16,35.55 15.3,34.85 16,34.85 15.25,33.7 15.95,33.7 15.25,33 15.95,33 16.85,33.9 17.55,33.9 16.85,33.2 17.55,33.2 29.35,24 29.35,23.3 30.05,23.3 27.95,24 28.65,24 27.95,23.3 28.65,23.3 27.9,22.35 28.6,22.35 27.9,21.65 28.6,21.65 29.35,22.35 30.05,22.35 29.35,21.65 30.05,21.65 27.9,20.65 28.6,20.65 27.9,19.95 28.6,19.95 29.4,20.65 30.1,20.65 29.4,19.95 30.1,19.95 40.85,24.1 40.85,23.4 41.55,23.4 39.45,24.1 40.15,24.1 39.45,23.4 40.15,23.4 39.4,22.45 40.1,22.45 40.85,22.45 41.55,22.45 39.4,21.55 40.1,21.55 40.85,21.55 41.55,21.55 39.4,20.55 40.1,20.55 39.4,19.85 40.1,19.85 40.9,20.55 41.6,20.55 40.9,19.85 41.6,19.85 74.75,24 75.45,24 74.75,23.3 75.45,23.3 73.35,24 74.05,24 73.35,23.3 74.05,23.3 73.3,22.35 74,22.35 74.75,22.35 75.45,22.35 73.3,21.55 74,21.55 74.75,21.55 75.45,21.55 73.3,20.55 74,20.55 73.3,19.85 74,19.85 74.8,20.55 75.5,20.55 74.8,19.85 75.5,19.85 62.1,21.6 62.8,21.6 63.55,21.6 64.25,21.6 62.1,20.6 62.8,20.6 62.1,19.9 62.8,19.9 63.6,20.6 64.3,20.6 63.6,19.9 64.3,19.9 63.55,24.15 64.25,24.15 63.55,23.45 64.25,23.45 62.15,24.15 62.85,24.15 62.15,23.45 62.85,23.45 62.1,22.5 62.8,22.5 63.55,22.5 64.25,22.5 52.75,24 52.75,23.3 53.45,23.12 51.35,24 52.05,24 51.35,23.3 52.05,23.3 51.3,22.35 52,22.35 52.75,22.35 53.45,22.35 51.3,21.55 52,21.55 52.75,21.55 53.45,21.55 51.3,20.55 52,20.55 51.3,19.85 52,19.85 52.8,20.55 53.5,20.55 52.8,19.85 53.5,19.85 50.2,17 50.9,17 50.2,16.3 50.9,16.3 59.8,16.75 60.5,16.75 59.8,16.05 60.5,16.05 71.5,16.55 72.2,16.55 71.5,15.85 72.2,15.85 53.75,25.75 31.8,27.85 32.5,27.85 31.8,27.15 32.5,27.15 43.45,28.2 44.15,28.2 43.45,27.5 44.15,27.5 74.5,31 69.25,42.45 69.25,41.75 69.95,42.45 70,41.75 77.4,45.65 70.7,49.6 70.7,48.9 70.7,48.2 70.7,47.5 75.22,56.02 75.92,56.02 75.22,55.33 75.92,55.33 33.8,47.1 34.5,47.1 35.15,47.1 35.85,47.1 37.6,47.15 38.3,47.15 38.35,49.2 37.65,49.2 35.85,49.25 35.15,49.25 34.45,49.25 33.75,49.25 34.9,53.6 34.9,52.9 34.15,53.6 34.15,52.9 24.55,49.2 25.35,49.2 24.55,48.45 25.35,48.5 55.35,27.8 55.33,28.55 56.65,29.8 56.62,30.73 40.6,30.95 40.6,30.1 40.6,29.25 40.6,28.4 39.6,32.95 40.15,33.55 40.75,34.15 52.55,29.35 52.55,30.2 52.55,31 48.45,30.55 48.52,29 79.75,16.55 79.75,17.45 81.25,16.62 74.2,17.85 61.35,42.4 61.4,41.45 57.8,37.85 59.1,37.85 60.45,37.85 70.55,30.05 71.25,30.05 71.25,29.35 70.55,29.35 65.9,30.9 66.6,30.9 65.9,30.2 66.6,30.2 1.07,68.9 41.55,41.77 42.1,42.25 42.65,41.77 43.2,42.23 34.95,39.67 36.08,39.62 34.42,39.12 35.48,39.12 23.57,44.23 24.35,44.2 23.57,43.5 24.32,43.5 5.1,4.3 5.8,4.3 5.1,3.6 5.8,3.6
  pour Top: 0.5,69.7 95.7,69.9 arc-90 97.7,68 97.6,42 84,42 84,24 97.3,23.9 97.4,0.3 0.5,0.3
  pour Bottom: 95.5,69.8 0.5,69.8 0.5,0.5 16.8,0.3 97.4,0.3 97.3,23.9 84,24 84,42 97.6,42 97.6,67.6 arc90
  pour Bottom (no thermals): 6.3,10.7 11.7,10.7 11.7,2.3 6.3,2.3
  pour Top (no thermals): 6.2,10.5 11.8,10.5 11.8,2.4 6.2,2.4
HEATER_EXT_1  (via drill 0.3)
  Top 0.152: 15.3,21.1 v16.6,21.1 | 15.3,21.1 U9.3 | v19.9,46 20.3,46 20.35,46.05 21.1,46.05 U11.9 | 15.3,21.1 14.1,21.1 R47.2
  Bottom 0.152: v16.6,21.1 18.2,21.1 18.6,21.5 18.9,21.5 20.5,23.1 20.5,36.6 20.45,36.65 20.45,36.95 20.2,37.2 20.2,44.15 20.4,44.35 20.4,45.5 v19.9,46
HEATER_EXT_2  (via drill 0.3)
  Top 0.152: v19.35,45.45 19.9,45.45 20,45.35 21.1,45.35 U11.10 | v19.45,53.25 19.45,53.3 17.4,53.3 16.2,54.5 15.6,54.5 U7.3 14.35,54.45 R48.2
  Bottom 0.152: v19.45,53.25 19.45,46.35 19.35,46.25 v19.35,45.45
HEATER_HBP  (via drill 0.3)
  Top 0.152: v19.85,44.6 19.95,44.7 21.1,44.7 U11.11 | v19.85,36.75 19.85,36.7 17.2,36.7 16.8,37.1 16.8,37.3 16.4,37.7 15.5,37.7 U8.3 15.45,37.7 R46.2
  Bottom 0.152: v19.85,36.75 v19.85,44.6
I2C2_SCL  (via drill 0.3)
  Top 0.152: v56.7,58.85 56.85,59 57.15,59 57.35,59.2 58.9,59.2 59.8,60.1 59.8,60.35 59.85,60.4 P9-EXPANSION_A.19 | v56.65,50.35 56.6,50.3 54.75,50.3 v54.7,50.35 | v54.7,49.25 54.5,49.45 41.45,49.45 40.2,48.2 28.9,48.2 28.55,47.85 v28.35,47.85 | v25.75,49.9 26.95,49.9 U11.26 | v82.3,55.45 83.65,55.45 83.67,55.38 83.88,55.38 84.4,54.85 87.25,54.85 87.3,54.8 88,54.8 U18.6 | v78.6,53.05 v79.9,53.05 | v56.7,53 v76.15,53
  Bottom 0.152: v56.7,58.85 56.7,57.35 56.65,57.3 56.65,53 | v56.65,50.35 56.65,53 | v54.7,49.25 v54.7,50.35 | v28.35,47.85 27.8,47.85 v25.75,49.9 | v79.9,53.05 v82.3,55.45 | v78.6,53.05 76.2,53.05 v76.15,53 | 56.65,53 v56.7,53
I2C2_SDA  (via drill 0.3)
  Top 0.152: v59.3,57.15 59.8,57.65 59.8,57.8 59.85,57.85 60.45,57.85 P9-EXPANSION_A.20 60.52,57.88 61,57.88 61.02,57.85 61.02,57.45 61.92,56.55 v67.92,56.55 | v59.1,49.8 41.35,49.8 40.1,48.55 29.45,48.55 29.05,48.95 29.05,49.55 28.1,50.5 27.85,50.5 27.75,50.6 27,50.6 U11.27 | v69.92,54.55 v76.22,54.55 | v78.62,54.55 v79.92,54.55 | v82.45,57 82.78,57 82.92,56.85 83.17,56.85 83.7,56.33 83.78,56.33 83.8,56.3 86.5,56.3 86.67,56.12 87.25,56.12 87.3,56.08 88,56.08 U18.5
  Bottom 0.152: v59.3,57.15 59.3,50 v59.1,49.8 | v67.92,56.55 v69.92,54.55 | v76.22,54.55 v78.62,54.55 | v79.92,54.55 80.25,54.55 81.45,55.75 81.45,55.8 82.1,56.45 82.1,56.65 v82.45,57
N$7  (via drill 0.3)
  Top 0.4: v33.08,20.43 32.95,20.45 32.9,20.4 32.1,20.4 U13.5 | v33,16.9 33,16.25 32.35,15.6 31.5,15.6 31.4,15.7 v31.3,15.7
  Bottom 0.4: v33.08,20.43 33.05,16.95 v33,16.9 | 26.1,13.25 26.2,13.4 26.2,13.8 28.1,15.7 v31.3,15.7
  Bottom 0.406: 26.1,13.25 26.1,7.3 27.1,6.3 X14.1
N$8
  Top 0.152: R45.2 LED8.C
N$9
  Top 0.406: R19.1 76.6,2.8 76.5,2.7 76.6,2.6 LED5.A
N$10
  Top 0.3: 41.8,52.33 41.8,52.8 39.7,52.8 39.7,52.55 41.75,52.55
N$13  (via drill 0.3)
  Top 0.4: v33.05,21.32 32.67,21.7 32.1,21.7 U13.7 | v30.7,13.45 30.6,13.55 27.3,13.55
  Top 0.406: v25.5,13.55 27.3,13.55
  Bottom 0.4: v33.05,21.32 32.05,20.38 32.1,15.15 v30.7,13.45
  Bottom 0.406: v25.5,13.55 25.5,9 24.6,8.1 24.6,5.5 X14.2
N$14  (via drill 0.3)
  Top 0.4: v24.95,14.15 25.05,14.25 31.05,14.25 31.2,14.1 33.1,14.1 34.35,15.35 v34.4,15.35 | v33.05,23.45 32.8,23.45 32.6,23.65 32.1,23.65 U13.10
  Bottom 0.4: 25,14.1 v24.95,14.15 | v33.05,23.45 33.4,23.45 34.85,22 34.85,15.8 v34.4,15.35
  Bottom 0.406: 25.1,14.2 25,14.1 24.8,13.9 24.8,13.3 24.9,13.2 24.9,9.3 22,6.4 22,5.5 X14.3
N$15  (via drill 0.3)
  Top 0.4: v34.05,21.85 33.65,22.3 33.6,22.35 32.1,22.35 U13.8 | v33,15 32.8,14.85 24.68,14.85 23.4,13.57 v22.45,13.57
  Bottom 0.4: v34.05,21.85 34.05,20.5 33.65,20.1 33.65,17.2 33.7,17.15 33.7,15.8 v33,15
  Bottom 0.406: v22.45,13.57 22,13.1 22,9.2 19.8,7 19.8,6.9 19.5,6.6 X14.4
N$16
  Top 0.152: C1.1 30.65,17.9 31.2,18.45 32.05,18.45 U13.2
N$17
  Top 0.152: C1.2 31.95,17.45 31.85,17.55 31.85,17.8 32.05,17.8 U13.1
N$18  (via drill 0.3)
  Top 0.152: U13.9 32.05,23 31.5,23 31.45,23.05 v31.15,23.05 | R1.2 28.55,27.85 28.6,27.8 28.6,27.4 v29.1,27.4
  Bottom 0.152: v29.1,27.4 29.1,27.1 29.65,26.55 29.65,25.05 30.43,24.27 30.43,24.18 31.15,23.45 v31.15,23.05
N$19  (via drill 0.3)
  Top 0.152: v31,21.23 31.15,21.1 31.45,21.1 31.5,21.05 32.05,21.05 U13.6 | R2.2 30.05,27.85 30.05,26.65 29.85,26.45 v28.75,26.45
  Bottom 0.152: v31,21.23 30.95,21.27 30.95,22.45 30.6,22.8 30.6,23.52 29.95,24.18 29.95,24.3 29.3,24.95 29.3,25.9 v28.75,26.45
N$21  (via drill 0.3)
  Top 0.3: v16.8,23 17.9,23 U9.5 | v17.7,29.35 R32.2 17.7,30.4
  Bottom 0.3: v16.8,23 16.3,23.5 16.27,29.35 v17.7,29.35
N$22
  Top 0.152: C2.2 29.43,17.32 31.1,19 31.5,19 31.6,19.1 32.05,19.1 U13.3
N$23
  Top 0.3: Q1.4 11.92,64.78 12.35,64.35 16.2,64.35 16.45,64.6 16.45,65.25 R37.1
N$30  (via drill 0.3)
  Top 0.4: v44.62,20.5 44.25,20.5 44.15,20.4 43.6,20.4 U14.5 | v39.6,15.4 v43.2,15.4
  Bottom 0.4: 44.55,20.55 v44.62,20.5 44.55,16.45 43.5,15.4 v43.2,15.4 | v39.6,15.4 39.6,14 39.2,13.6 39.2,13.2
  Bottom 0.406: 39.2,13.2 39.2,12.7 39.15,12.6 39.15,11.57 39.4,11.32 39.4,10.57 39.15,10.32 39.15,9.4 38.8,9.05 38.8,6.9 38.5,6.6 X15.1
N$31  (via drill 0.3)
  Top 0.4: v44.55,21.5 44.35,21.7 43.6,21.7 U14.7
  Top 0.406: v40.5,7.8 37.1,7.8 v36.7,7.4
  Bottom 0.4: v44.55,21.5 43.95,20.8 43.95,17.25 41.4,14.7 41.4,13.2 41.6,13 41.6,12.75
  Bottom 0.406: 41.6,12.75 41.6,8.9 v40.5,7.8 | v36.7,7.4 36.3,7 36.3,6.9 36,6.6 36,5.5 X15.2
N$32  (via drill 0.3)
  Top 0.4: v44.55,23.3 44.45,23.3 44.1,23.65 43.6,23.65 U14.10 | v45.55,14.7 45,14.7 43.95,13.65 43.85,13.6
  Top 0.406: 43.85,13.6 34.5,13.6 34.25,13.35 v34.25,13.1
  Bottom 0.4: v44.55,23.3 45.55,22.3 45.65,22.1 45.75,22 45.75,21.3 46.05,20.98 46.05,20.05 45.7,19.7 45.65,14.8 v45.55,14.7
  Bottom 0.406: v34.25,13.1 34.1,13.1 34.05,13.15 33.8,12.9 33.8,7 33.4,6.6 33.4,5.5 X15.3
N$33  (via drill 0.3)
  Top 0.4: 42,14.2 43.6,14.2 45.25,15.85 46.3,15.85 v46.45,16 | v46.48,19.45 46.48,20.98 45.33,22.12 45.1,22.35 43.6,22.35 U14.8
  Top 0.406: 42,14.2 34.2,14.2 33.45,13.45 31.85,13.45 v31.6,13.2
  Bottom 0.4: v46.45,16 v46.48,19.45
  Bottom 0.406: v31.6,13.2 31.5,13.1 31.5,12 31.3,11.8 31.3,11.7 31.2,11.6 31.2,10.2 31.3,10.1 31.3,9.2 31.2,9.1 31.2,6.9 30.9,6.6 X15.4
N$34  (via drill 0.3)
  Top 0.152: v42.4,18.35 42.5,18.45 43.55,18.45 U14.2 | v42.4,17.35 42.2,17.15 C3.1
  Bottom 0.152: v42.4,17.35 v42.4,18.35
N$35
  Top 0.152: C3.2 43.5,17.4 43.55,17.45 43.55,17.75 U14.1
N$36  (via drill 0.3)
  Top 0.152: U14.9 42.67,22.98 v42.65,23 | v42.05,26.77 R3.2
  Bottom 0.152: v42.65,23 42.65,23.52 42.05,24.12 v42.05,26.77
N$37  (via drill 0.3)
  Top 0.152: U14.6 42.62,21.02 v42.5,21.15 | v40.55,27.05 40.1,27.05 R4.2
  Bottom 0.152: v42.5,21.15 42.5,22.35 42.1,22.75 42.1,23.62 41.6,24.12 41.6,26 v40.55,27.05
N$38  (via drill 0.3)
  Top 0.152: v41.65,18.7 41.95,18.7 42.15,18.9 42.35,18.9 42.45,19 43,19 43.1,19.1 43.55,19.1 U14.3 | v41.55,17.35 41.02,16.82 C4.2
  Bottom 0.152: v41.65,18.7 41.65,17.45 v41.55,17.35
N$41  (via drill 0.3)
  Top 0.3: v17.45,57 18.3,57 18.3,56.4 U7.5 | v18.25,61.9 17.4,61.9 R37.2 17.4,62.9
  Bottom 0.3: v17.45,57 17.45,61.3 17.45,61.9 v18.25,61.9
N$48  (via drill 0.3)
  Top 0.4: v56.7,20.25 56.49,20.27 U15.5
  Bottom 0.4: v56.7,20.25 56.75,20.1 56.73,18.65 52.67,14.65 52.23,14.22 52.25,13.47
  Bottom 0.406: 52.25,13.47 51.85,13.07 51.85,11.65 52.2,11.25 52.2,10.6 51.8,10.2 51.8,8.2 49.9,6.3 X16.1
N$49  (via drill 0.3)
  Top 0.4: v56.42,21.57 56.05,21.6 55.5,21.6 U15.7
  Bottom 0.4: v56.42,21.57 56,21.1 56,19.45 50.3,13.7 50.3,13.65 49.8,13.15
  Bottom 0.406: 49.8,13.15 49.4,12.8 49.3,12.7 49.3,11.7 49.4,11.6 49.4,10.2 49.3,10.1 49.3,9 48.2,7.9 48.2,7.5 47.7,7 47.7,6.9 47.4,6.6 47.4,5.5 X16.2
N$50  (via drill 0.3)
  Top 0.4: v58.3,15.8 58.2,15.9 56.65,15.9 56,15.25 46.95,15.25 v46.55,14.85 | v56.45,23.15 56.4,23.15 56,23.55 55.5,23.55 U15.10
  Bottom 0.4: v46.55,14.85 46.55,13.15 46.7,13 46.7,12.72 | v56.45,23.15 56.45,22.82 57.48,21.8 57.8,21.45 58.17,21.07 58.2,21.02 58.2,18.6 58.25,18.55 58.3,18.45 v58.3,15.8
  Bottom 0.406: 46.7,12.72 46.7,11.7 46.4,11.4 46.4,10.2 46.5,10.1 46.5,9.15 46.4,9.05 46.4,8 44.8,6.4 44.8,5.5 X16.3
N$51  (via drill 0.3)
  Top 0.4: v57.2,20.95 57.1,21.1 57.1,21.95 56.8,22.25 55.5,22.25 U15.8
  Top 0.406: v54.7,13.25 54.3,12.85 54.3,8.95 53.2,7.8 43.4,7.8 v43,7.4
  Bottom 0.4: v57.2,20.95 57.6,20.5 57.6,17.1 55.25,14.85 55.25,14.1 54.8,13.65 54.8,13.35 v54.7,13.25
  Bottom 0.406: v43,7.4 42.6,7 42.6,6.9 42.3,6.6 X16.4
N$52
  Top 0.152: C5.1 54.08,17.82 54.6,18.35 55.45,18.35 U15.2
N$53
  Top 0.152: C5.2 55.38,17.15 55.45,17.23 55.45,17.65 U15.1
N$54  (via drill 0.3)
  Top 0.152: U15.9 54.45,22.9 v54.45,23.75 | v53.9,26.95 52.1,26.95 R5.2
  Bottom 0.152: v54.45,23.75 54.3,23.85 53.5,24.65 53.5,25.15 53.15,25.5 53.15,26.2 v53.9,26.95
N$55  (via drill 0.3)
  Top 0.152: U15.6 54.48,20.93 v54.4,21 | v52.7,28.1 R6.2
  Bottom 0.152: v54.4,21 54.38,22.95 54.12,23.18 53.92,23.38 53.92,23.6 53.1,24.43 53.1,24.95 52.65,25.4 52.65,28 v52.7,28.1
N$56
  Top 0.152: C6.2 53.15,17.55 54.5,18.9 54.9,18.9 55,19 55.45,19 U15.3
N$58
  Top 0.152: R27.1 25.25,53.55 25.25,52.85 23.65,51.25 21.95,51.25 21.9,51.2 21.15,51.2 U11.1
N$59  (via drill 0.3)
  Top 0.152: v24.1,50.9 22.6,50.9 22.3,50.6 21.15,50.6 U11.2 | v24.1,52.7 24.1,53.55 R26.1
  Bottom 0.152: v24.1,50.9 v24.1,52.7
N$60
  Top 0.152: Q2.4 12.49,48.43 13.07,47.85 16.35,47.85 17.02,48.52 17.02,48.58 R31.1
  Top 0.3: R31.1 17.6,49.1
N$61  (via drill 0.3)
  Top 0.3: v18.6,40.6 18.2,40.1 18.2,39.6 U8.5 | v18.6,47.8 18.5,47.9 17.6,47.9 R31.2
  Bottom 0.3: v18.6,40.6 18.55,40.65 17.5,41.7 17.5,46.7 v18.6,47.8
N$62  (via drill 0.3)
  Top 0.152: v59,35.75 60.2,35.75 U4.2 | v59.05,21.1 59.05,20.4 59.7,19.75 60.1,19.75 U16.25
  Bottom 0.152: v59,35.75 59.05,35.7 59.05,26.1 58.35,25.4 58.35,24.5 58.7,24.07 58.7,22.52 59.08,22.18 v59.05,21.1
N$63  (via drill 0.3)
  Top 0.152: v61.45,35.05 60.25,35.05 U4.3 | v61.23,19.9 61.23,19.6 60.83,19.2 60.55,19.2 60.45,19.1 60.15,19.1 U16.26
  Bottom 0.152: v61.45,35.05 61.2,34.8 v61.23,19.9
N$64  (via drill 0.3)
  Top 0.152: v10.53,63.4 10.5,63.4 10.1,63 10.1,61.16 | D3.A 20.27,59.25 C57.1 | v10.75,68.28 11.4,67.6 11.9,67.1 12.38,67.1 LED1.C
  Top 0.3: 16.3,59.3 17.5,59.3 C57.1 | Q1.5 Q1.6 | 16.3,59.3 | X21.2 10.1,61.16 | Q1.7 Q1.8 15.85,59.75 16.3,59.3
  Top 3: Q1.6 Q1.7 | Q1.5 10.59,59.75 X21.2
  Bottom 0.152: v10.53,63.4 11.9,64.78 11.9,67.08 v10.75,68.28
N$66  (via drill 0.3)
  Top 0.4: v67.12,20.52 66.95,20.5 66.85,20.4 66.3,20.4 U16.5
  Top 0.406: X17.1 v63.73,5.5
  Bottom 0.4: 64.28,7.45 64.4,7.58 64.4,14.05 66.5,16.15 66.5,20.1 66.9,20.5 v67.12,20.52
  Bottom 0.406: 64.28,7.45 63.75,6.98 63.73,6.95 v63.73,5.5
N$67  (via drill 0.3)
  Top 0.4: v68.25,21.6 68.15,21.7 66.3,21.7 U16.7
  Top 0.406: v65.83,13.75 65.4,13.32 59.73,13.32 v59.6,13.2
  Bottom 0.4: v68.25,21.6 68.38,21.48 68.38,19.62 68.1,19.35 68.1,16.35 65.9,14.15 65.9,13.85 v65.83,13.75
  Bottom 0.406: v59.6,13.2 59.48,13.07 59.45,7.2 59.05,6.85 | 59.05,6.85 58.8,6.6 58.8,5.5 X17.2 | 59.05,6.85 59.1,6.9
N$68  (via drill 0.3)
  Top 0.4: v56.7,14.9 v64.3,14.9 | v67.2,23.55 67.05,23.6 66.35,23.6 U16.10
  Bottom 0.4: 56.7,11.7 v56.7,14.9 | v67.2,23.55 66.85,23.25 66.85,21.3 65.3,19.65 65.3,17.1 65.15,17 64.55,16.4 64.55,15.25 64.3,15 v64.3,14.9
  Bottom 0.406: 56.7,11.7 56.6,11.6 56.6,10.2 56.7,10.1 56.7,9.2 56.5,9 56.5,6.9 56.2,6.6 56.2,5.5 X17.3
N$69  (via drill 0.3)
  Top 0.4: 65,13.9 65.55,14.43 68.55,14.43 v68.8,14.57 | v68.85,22.3 66.31,22.3 U16.8
  Top 0.406: 65,13.9 55.75,13.9 55.33,14.35 53.7,14.35 v53.27,13.93
  Bottom 0.4: v68.85,22.3 68.97,22.15 68.97,19.3 68.8,19.15 v68.8,14.57
  Bottom 0.406: v53.27,13.93 53.27,13.62 54.15,12.75 54.15,8.85 54,8.7 54,6.9 53.7,6.6 X17.4
N$70
  Top 0.152: C7.1 64.55,17.2 65.8,18.45 66.25,18.45 U16.2
N$71
  Top 0.152: C7.2 65.85,17.2 66,17.35 66,17.8 66.25,17.8 U16.1
N$72  (via drill 0.3)
  Top 0.152: R7.2 63,28 63.05,27.95 63.05,27 v64.45,25.6 | v65.3,23.05 65.35,23 66.25,23 U16.9
  Bottom 0.152: v64.45,25.6 64.45,24.75 65.2,24 65.2,23.15 v65.3,23.05
N$73  (via drill 0.3)
  Top 0.152: R8.2 65.35,27.95 66.25,27.05 v66.3,27.05 | v65.3,21.05 66.25,21.05 U16.6
  Bottom 0.152: v66.3,27.05 66.3,22.05 v65.3,21.05
N$74
  Top 0.152: C8.2 63.65,17.2 63.95,17.5 64.15,17.5 65.75,19.1 66.25,19.1 U16.3
N$76  (via drill 0.3)
  Top 0.152: v22.45,50.05 22.4,50.05 22.35,50 22,50 21.9,49.9 21.15,49.9 U11.3 | v22.45,52.7 22.85,53.1 22.85,53.55 R25.1
  Bottom 0.152: v22.45,50.05 v22.45,52.7
N$78  (via drill 0.3)
  Top 0.152: v78.65,35.75 77.45,35.75 U5.15 | v77.1,26.95 76.7,26.95 76.5,26.75 73.85,26.75 73.8,26.8 73.35,26.8 73.3,26.75 72.15,26.75 70.58,28.32 68.83,28.32 v68,27.5 | v68.62,23.48 68.75,23.6 70.7,23.6 70.75,23.55 71.3,23.55 U17.19
  Bottom 0.152: v78.65,35.75 77.6,34.8 76.85,34.05 76.83,34.02 76.83,29.82 77.6,29.05 77.6,27.5 v77.1,26.95 | v68,27.5 68,24.15 68.5,23.65 v68.62,23.48
N$79  (via drill 0.3)
  Top 0.152: v69.3,35.7 69.7,35.7 70.35,36.35 70.5,36.35 70.55,36.4 71.55,36.4 U5.1 | v69.28,23.05 69.6,22.75 69.6,21.6 70.9,20.3 71.3,20.3 U17.24
  Bottom 0.152: v69.3,35.7 69.3,34.9 69.5,34.7 69.45,25.25 69.2,25 69.2,23.1 v69.28,23.05
N$80  (via drill 0.3)
  Top 0.152: v69.85,35.15 70.45,35.75 71.55,35.75 U5.2 | v69.5,18.75 69.9,18.75 70.85,19.65 71.3,19.65 U17.25
  Bottom 0.152: v69.85,35.15 69.85,25.12 69.6,24.88 69.6,23.6 69.83,23.38 69.83,22.85 69.62,22.62 69.62,21 69.45,20.82 69.45,18.9 69.42,18.88 v69.5,18.75
N$81  (via drill 0.3)
  Top 0.152: v72.8,35.05 71.6,35.05 U5.3 | v72.35,20.77 72.35,19.3 72.15,19.1 71.75,19.1 71.65,19 71.35,19 U17.26
  Bottom 0.152: v72.8,35.05 72.4,34.65 v72.35,20.77
N$82  (via drill 0.3)
  Top 0.152: v73.9,33.15 73.3,33.75 72.9,33.75 72.2,34.45 71.6,34.45 U5.4 | v73.7,25.95 72.6,25.95 72.2,25.55 71.95,25.55 71.9,25.5 71.35,25.5 U17.16
  Bottom 0.152: v73.9,33.15 73.9,32.55 73.47,32.15 73.47,26.3 v73.7,25.95
N$83  (via drill 0.3)
  Top 0.152: v68.85,32.2 70.4,33.75 71.55,33.75 U5.5 | v68.83,27.52 69.25,27.52 70.25,26.52 70.25,25.1 70.45,24.9 70.7,24.9 70.75,24.85 71.3,24.85 U17.17
  Bottom 0.152: v68.83,27.52 v68.85,32.2
N$84  (via drill 0.3)
  Top 0.4: v79.08,15.35 79.03,15.38 75.62,15.38 75.55,15.32 v75.3,15.1 | v79.05,20.3 78.95,20.32 78.83,20.3 77.5,20.3 U17.5
  Bottom 0.4: v79.08,15.35 79.05,15.4 v79.05,20.3 | v75.3,15.1 75.3,13.32 74.7,12.72
  Bottom 0.406: 74.7,12.72 74.7,11.65 75.35,11 75.35,10.9 74.7,10.25 74.7,8.4 72.7,6.4 X18.1
N$85  (via drill 0.3)
  Top 0.4: v78.28,21.55 77.5,21.55 U17.7
  Top 0.406: v79.2,13.6 77.9,13.6 77.67,13.38 72.42,13.38 v72.2,13.2
  Bottom 0.4: v78.28,21.55 78.28,20.77 78.38,20.68 78.4,14.65 79.05,13.75 79.05,13.7 v79.2,13.6
  Bottom 0.406: v72.2,13.2 72,12.9 72,11.8 72.5,11.3 72.5,10.5 72,10 72,8.2 70.6,6.9 70.5,6.9 70.2,6.6 70.2,5.6 X18.2
N$86  (via drill 0.3)
  Top 0.4: v78.28,23.43 78,23.55 77.5,23.55 U17.10 | 77.5,14.2 v77.6,14.25 | v69.5,11.05 69.5,13 69.7,13.2
  Top 0.406: 77.5,14.2 77.53,14.2 77.3,14.03 72.6,14.03 72.5,14.1 70.6,14.1 69.7,13.2
  Bottom 0.4: v78.28,23.43 77.8,22.9 77.8,22.35 77.58,22.12 77.58,20.57 77.8,20.35 77.8,18.2 77.15,17.55 77.15,14.7 v77.6,14.25 | 69.4,10.1 69.4,10.93 v69.5,11.05
  Bottom 0.406: 69.4,10.1 69.4,8.3 67.6,6.5 67.6,5.6 X18.3
N$87  (via drill 0.3)
  Top 0.4: v84.6,22.15 82.92,22.15 81.8,23.27 80.78,23.27 79.75,22.25 77.5,22.25 U17.8
  Top 0.406: v85,9 84.1,8.1 80.5,8.1 80.4,8.15 75.4,8.15 74.75,7.5 66.6,7.5 65.6,6.5 65.6,5.7 65.5,5.6 X18.4
  Bottom 0.4: v84.6,22.15 84.75,22.15 85.33,21.55 85.33,18.38 85.2,18.25 85.2,9.25
  Bottom 0.406: v85,9 85.2,9.25
N$88
  Top 0.152: C9.1 76.35,16.55 76.35,17.6 77,18.25 77.05,18.25 77.15,18.35 77.45,18.35 U17.2
N$89
  Top 0.152: C9.2 77.65,16.6 77.65,17.35 77.7,17.4 77.7,17.7 77.5,17.7 U17.1
N$90  (via drill 0.3)
  Top 0.152: v76.4,22.9 77.45,22.9 U17.9 | v74.5,27.9 74.15,27.9 74.1,27.95 R9.2
  Bottom 0.152: v76.4,22.9 76,23.27 76,26.4 v74.5,27.9
N$91  (via drill 0.3)
  Top 0.152: v76.38,20.95 77.45,20.95 U17.6 | v77.03,27.95 R10.2
  Bottom 0.152: v76.38,20.95 76.38,22.05 76.95,22.62 76.95,23.32 76.58,23.7 76.58,26.5 76.5,26.57 76.5,27.25 77.03,27.77 v77.03,27.95
N$92
  Top 0.152: C10.2 75.4,17.55 76.85,19 77.45,19 U17.3
N$93  (via drill 0.3)
  Top 0.152: v73.05,32.8 72.75,33.1 72.45,33.1 72.4,33.15 71.6,33.15 U5.6 | v73.05,25.1 72.65,25.1 72.35,24.8 72.35,24.75 72.3,24.7 72.3,24.65 72.35,24.6 72.35,22.85 71.75,22.25 71.35,22.25 U17.21
  Bottom 0.152: v73.05,25.1 v73.05,32.8
N$94  (via drill 0.3)
  Top 0.152: v22.35,49.25 21.95,49.25 21.9,49.3 21.15,49.3 U11.4 | v21.65,52.7 21.65,53.55 R28.1
  Bottom 0.152: v22.35,49.25 21.65,49.95 v21.65,52.7
N$95  (via drill 0.3)
  Top 0.152: v22.35,48.45 22.15,48.65 21.15,48.65 U11.5 | v20.8,52.7 20.55,52.95 20.55,53.55 20.4,53.55 R29.1
  Bottom 0.152: v22.35,48.45 21.3,49.5 21.3,52.2 v20.8,52.7
N$96
  Top 0.152: R11.1 LED4.A
N$97  (via drill 0.3)
  Top 0.152: v30.25,32.9 31.05,32.1 32.15,32.1 U1.10 | v30.25,35.95 30.1,36.1 R12.1
  Bottom 0.152: v30.25,32.9 v30.25,35.95
N$98  (via drill 0.3)
  Top 0.152: v64.85,32.25 64.95,32.25 65.15,32.45 66.05,32.45 U4.10 | v63.1,37.35 63.95,37.35 R33.1
  Bottom 0.152: v64.85,32.25 63.1,34 v63.1,37.35
N$99  (via drill 0.3)
  Top 0.152: R34.1 75.2,36.65 75.55,36.3 v76.15,36.3 | v76.2,32.45 77.4,32.45 U5.10
  Bottom 0.152: v76.15,36.3 76.2,36.25 v76.2,32.45
N$100  (via drill 0.3)
  Top 0.152: v42.45,32.4 43.65,32.4 U2.10 | v42.45,35.9 42.1,35.9 41.55,36.45 R35.1
  Bottom 0.152: v42.45,32.4 v42.45,35.9
N$101  (via drill 0.3)
  Top 0.152: v52.75,32.4 55.3,32.4 U3.10 | v52.35,37.35 53.2,37.35 R36.1
  Bottom 0.152: v52.75,32.4 52.35,32.8 v52.35,37.35
N$112  (via drill 0.3)
  Top 0.152: v27.9,53.52 27.85,53.58 26.68,53.58 R30.1 | v28.18,48.65 28.15,48.62 U11.24
  Bottom 0.152: v27.9,53.52 27.9,48.92 v28.18,48.65
N$114  (via drill 0.3)
  Top 0.3: v82.85,15.3 82.9,15.2 83.7,14.3 83.75,14.25 84.4,14.25 84.45,14.3 86.05,14.3 86.3,14.55 87,14.55 87.6,13.95 v87.6,13.6 | v87.6,10.05 86.9,9.35 86.5,9.35 v86.35,9.2 | v70.75,45.9 64.1,45.9 62.65,47.35 56.6,47.35 Q5.4 | v82.3,41.3 82.03,41.3 81.78,41.05 75.22,41.05 75,41.27 v74.95,41.3
  Top 0.406: v84.5,4 85.1,4.6 85.1,4.8 85.6,5.3 X6.2 | v84.4,1.3 84.3,1.2 83.5,1.2 LED7.C
  Top 0.5: v56.4,46.55 56.4,47.7 56.85,48.15 Q5.4 | v56.4,42.65 57.5,42.65 Q5.2
  Bottom 0.3: v82.85,15.3 82.85,16.75 82.05,17.55 82.05,18.8 82.3,19.05 82.3,25.75 81.5,26.6 81.5,27.62 81.65,27.77 81.62,37.1 81.2,37.52 81.2,40.05 81.5,40.4 v82.3,41.3 | v87.6,10.05 v87.6,13.6 | v86.35,9.2 86.35,8.85 86.5,8.7 86.5,7.95 85.8,7.25 85.8,7.05 85.65,6.9 85.65,5.5 X6.2 | v74.95,41.3 74.95,41.7 v70.75,45.9
  Bottom 0.406: v84.5,4 84.4,3.9 v84.4,1.3
  Bottom 0.5: v56.4,46.55 v56.4,42.65
N$115  (via drill 0.3)
  Top 0.3: v92.4,14.43 92.35,14.43 91.7,15.07 84.15,15.1 v84.05,14.9 | v84.05,16.65 84,16.5 v83,17.5 | v82.45,40.45 82.4,40.48 82.38,40.55 65.8,40.55 65.55,40.8 65.55,42.05 Q4.2
  Top 0.406: v91.4,3.7 92.1,4.4 92.1,5.1 92.4,5.4 X5.2 | v91.2,1.3 91.1,1.2 90.3,1.2 LED6.C
  Top 0.5: v64.45,43 64.5,42.95 65.55,42.95 Q4.2 | v64.45,46.85 64.45,48.45 65.55,48.45 Q4.4
  Bottom 0.3: X5.2 92.43,14.46 v92.4,14.43 | v84.05,14.9 v84.05,16.65 | v83,17.5 82.55,17.95 82.55,18.6 82.78,18.82 82.78,26 81.97,26.8 81.97,27.43 82.17,27.62 82.15,37.33 81.8,37.67 81.8,39.73 v82.45,40.45
  Bottom 0.406: v91.4,3.7 91.4,1.5 v91.2,1.3
  Bottom 0.5: v64.45,43 v64.45,46.85
N$116  (via drill 0.3)
  Top 0.3: v81.2,41.9 80.83,41.52 75.8,41.52 75.58,41.75 75.55,41.75 75.3,42 74.2,42 73.95,41.75 v73.5,41.75 73.45,41.75 | v69.65,50.1 62,50.1 61.1,51 54.45,51 53.95,50.5 v50.05,50.5 | v50.35,46.3 50.35,47.4 Q6.4
  Top 0.406: v77.5,1.3 77.4,1.2 76.6,1.2 LED5.C | v77.6,5.6 X4.2
  Top 0.5: v48.6,42.35 48.65,42.3 49.7,42.3 Q6.2 | v48.6,46.2 48.6,47.8 49.7,47.8 Q6.4
  Bottom 0.3: X4.2 78.85,5.6 78.85,6.45 79.3,6.45 82.2,9.35 82.2,16.65 81.53,17.38 81.53,18.93 81.78,19.18 81.8,25.55 81.03,26.32 81.03,30.65 81.15,30.8 81.15,36.92 80.72,37.35 80.72,40.38 81.2,40.85 v81.2,41.9 | v73.5,41.75 73.5,41.8 69.9,45.4 69.9,49.85 v69.65,50.1 | v50.05,50.5 50.05,46.6 v50.35,46.3